# EAGLE design shield (EAGLE 6.6.0)
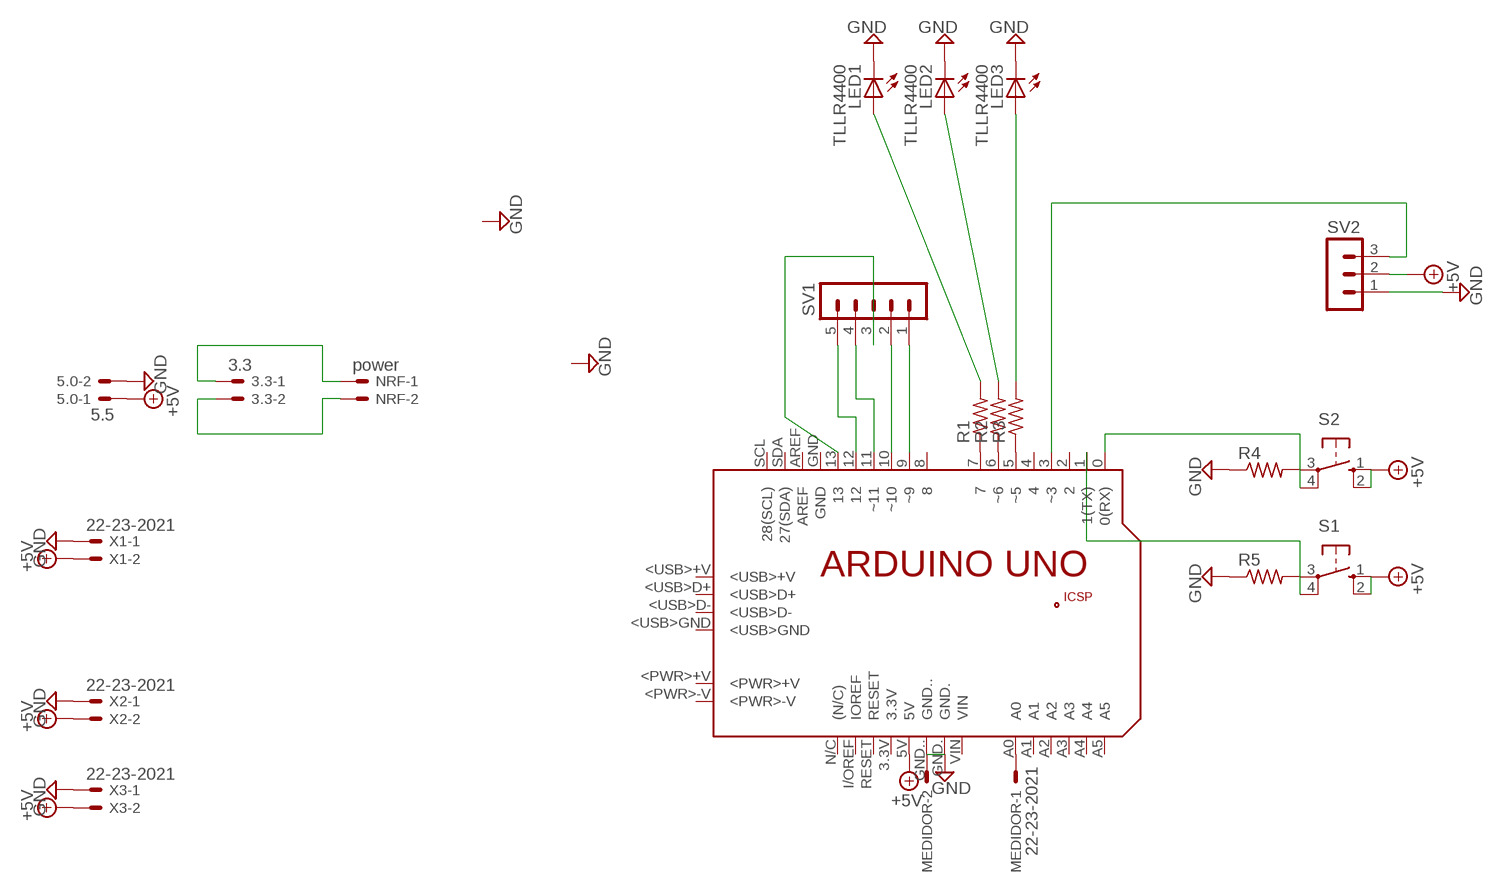
[diagram p0: schematic, sheet 1]

## Parts
3.3  3.3  22-23-2021  [22-23-2021]
5.0  5.5  22-23-2021  [22-23-2021]
LED1  TLLR4400  [LED3MM]
LED2  TLLR4400  [LED3MM]
LED3  TLLR4400  [LED3MM]
MEDIDOR  22-23-2021  [22-23-2021]
NRF  power  22-23-2021  [22-23-2021]
PCB1  ARDUINO_UNO  [ARDUINO_UNO]
R1  R-US_0613/15  [P0613/15]
R2  R-US_0613/15  [P0613/15]
R3  R-US_0613/15  [P0613/15]
R4  R-US_0613/15  [P0613/15]
R5  R-US_0613/15  [P0613/15]
S1  10-XX  [B3F-10XX]
S2  10-XX  [B3F-10XX]
SV1  MA05-1  [MA05-1]
SV2  MA03-1  [MA03-1]
X1  22-23-2021  [22-23-2021]
X2  22-23-2021  [22-23-2021]
X3  22-23-2021  [22-23-2021]

## Nets
+5V: 5.0.1 PCB1.5V S1.1(S) S1.2(S1) S2.1(S) S2.2(S1) SV2.2 X1.2 X2.2 X3.2
GND: 5.0.2 LED1.K(C) LED2.K(C) LED3.K(C) MEDIDOR.2 PCB1.GND. PCB1.GND.. R4.1 R5.1 SV2.1 X1.1 X2.1 X3.1
N$1: PCB1.3(~3) SV2.3
N$2: PCB1.9(~9) SV1.1
N$3: PCB1.10(~10) SV1.2
N$4: PCB1.13 SV1.3
N$5: PCB1.11(~11) SV1.4
N$6: PCB1.12 SV1.5
N$7: PCB1.0(0(RX)) R4.2 S2.3(P) S2.4(P1)
N$8: PCB1.7 R1.1
N$9: PCB1.6(~6) R2.1
N$10: PCB1.5(~5) R3.1
N$11: LED3.A R3.2
N$12: LED2.A R2.2
N$13: LED1.A R1.2
N$14: PCB1.1(1(TX)) R5.2 S1.3(P) S1.4(P1)
N$15: MEDIDOR.1 PCB1.A0
N$16: 3.3.1 NRF.1
N$17: 3.3.2 NRF.2
Unconnected: PCB1.2 PCB1.3.3V PCB1.4 PCB1.8 PCB1.+5V PCB1.<PWR>+V PCB1.<PWR>-V PCB1.<USB>+V PCB1.<USB>D+ PCB1.<USB>D- PCB1.<USB>GND PCB1.A1 PCB1.A2 PCB1.A3 PCB1.A4 PCB1.A5 PCB1.AREF PCB1.GND PCB1.GND_ PCB1.I/OREF(IOREF) PCB1.MISO PCB1.MOSI PCB1.N/C((N/C)) PCB1.RESET PCB1.RESET. PCB1.SCK PCB1.SCL(28(SCL)) PCB1.SDA(27(SDA)) PCB1.VIN

## Library data of the parts
3.3 5.0 MEDIDOR NRF X1-X3 = con-molex:22-23-2021: .100" (2.54mm) Center Header - 2 Pin; MF: MOLEX; MPN: 22-23-2021; OC_FARNELL: 1462926; OC_NEWARK: 25C3832
LED1-LED3 = led:TLLR4400: Low Current (2mA) LED 3 mm Tinted Diffused Package color RED Source: Data sheet <http://www.farnell.com/datasheets/391100.pdf>; MF: VISHAY SEMICONDUCTOR; OC_FARNELL: 1612437
PCB1 = E14_Arduino_revC:ARDUINO_UNO: Device for representing an Arduino Uno board with a footprint in an EAGLE design. Created by Dave Young for Element14. More EAGLE documentation at: http://www.element14.com/community/community/knode/cadsoft_eagle
R1-R5 = rcl:R-US_: RESISTOR, American symbol
S1 S2 = switch-omron:10-XX: OMRON SWITCH; MPN: B3F-1000; OC_FARNELL: 176432; OC_NEWARK: 36M3542
SV1 = con-lstb:MA05-1: PIN HEADER; OC_FARNELL: unknown; OC_NEWARK: unknown
SV2 = con-lstb:MA03-1: PIN HEADER; OC_FARNELL: unknown; OC_NEWARK: unknown

## Board
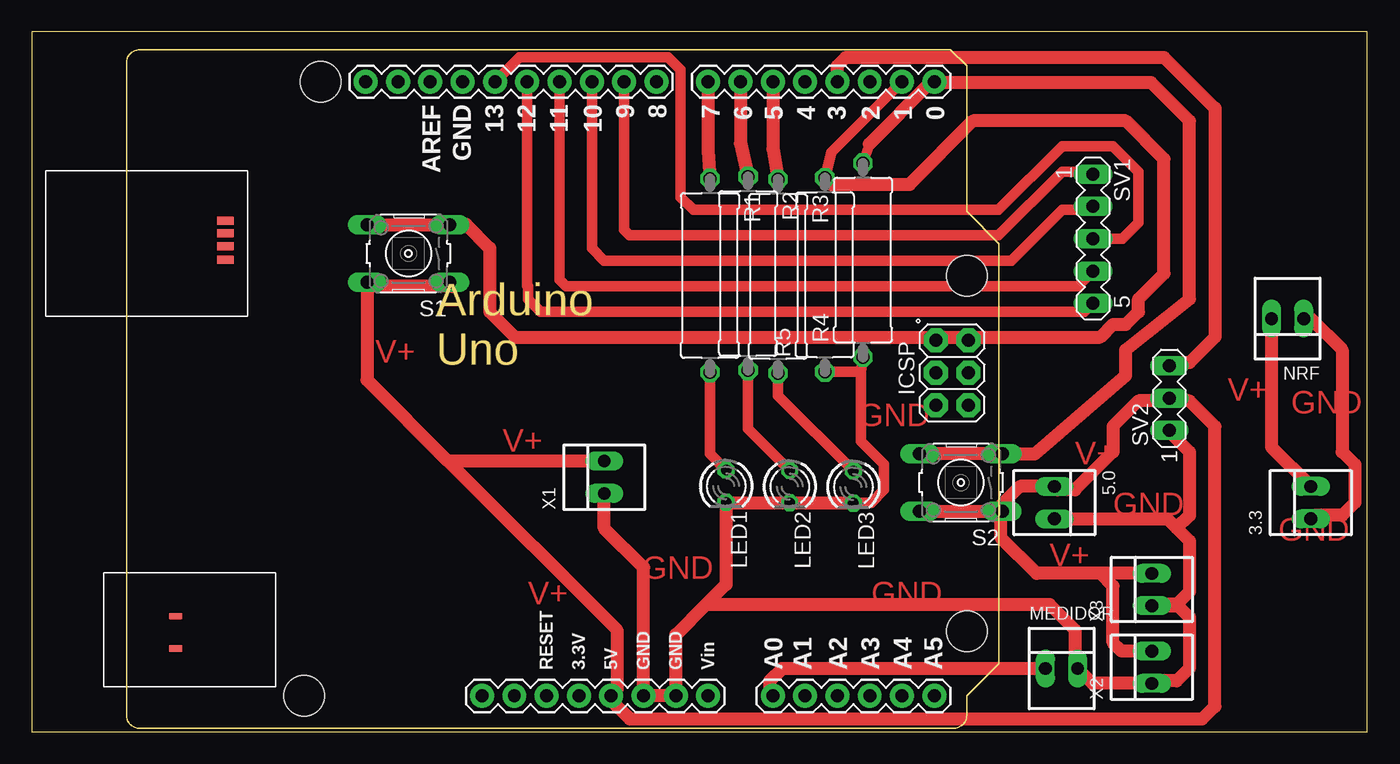
[diagram p1: board, top side]

Size 105 x 55 mm. Coordinates in mm from the lower left corner, seen from the top.
Outline: 0,0 105,0 105,55 0,55 0,0
Copper layers (1*16): Top 0.035mm / dielectric 1.5mm / Bottom 0.035mm
Design rules "default": minimum track width 10mil, minimum drill 24mil, track to track 8mil, track to pad 8mil, pad to pad 8mil, via to via 8mil, smd to smd 8mil, copper to edge 40mil, drill to drill 8mil, minimum pad ring 10mil, minimum via ring 8mil, stop-mask expansion 4mil, vias tented up to drill 0mil, thermal gap 10mil

### Footprints (pad centres in the part's own frame; a part is rotated, then mirrored left to right if it is on the bottom)
22-23-2021 = drill 1 long: 1 -1.27,0; 2 1.27,0
LED3MM = drill 0.813 octagon: A -1.27,0; K 1.27,0
ARDUINO_UNO = drill 1.016 pad 1.88: 0 63.5,50.8; 1 60.96,50.8; 2 58.42,50.8; 3 55.88,50.8; 3.3V 35.56,2.54; 4 53.34,50.8; 5 50.8,50.8; 5V 38.1,2.54; 6 48.26,50.8; 7 45.72,50.8; 8 41.656,50.8; 9 39.116,50.8; 10 36.576,50.8; 11 34.036,50.8; 12 31.496,50.8; 13 28.956,50.8; A0 50.8,2.54; A1 53.34,2.54; A2 55.88,2.54; A3 58.42,2.54; A4 60.96,2.54; A5 63.5,2.54; AREF 23.876,50.8; GND 26.416,50.8; GND. 43.18,2.54; GND.. 40.64,2.54; I/OREF 30.48,2.54; N/C 27.94,2.54; RESET 33.02,2.54; SCL 18.796,50.8; SDA 21.336,50.8; VIN 45.72,2.54 | drill 1.016 pad 1.88 octagon: +5V 66.167,30.48; GND_ 66.167,25.4; MISO 63.627,30.48; MOSI 66.167,27.94; RESET. 63.627,25.4; SCK 63.627,27.94 | smd 1.016 x 0.508: <PWR>+V 3.861,8.814; <PWR>-V 3.861,6.274 | smd 1.27 x 0.635: <USB>+V 7.772,39.878; <USB>D+ 7.772,38.887; <USB>D- 7.772,37.871; <USB>GND 7.772,36.83 | hole 3.2: 66.04,7.62; 66.04,35.56; 15.24,50.8; 13.97,2.54
P0613/15 = drill 1.016 octagon: 1 -7.62,0; 2 7.62,0
B3F-10XX = drill 1.016 long: 1 -3.251,2.261; 2 3.251,2.261; 3 -3.251,-2.261; 4 3.251,-2.261
MA05-1 = drill 1.016 long: 1 -5.08,0; 2 -2.54,0; 3 0,0; 4 2.54,0; 5 5.08,0
MA03-1 = drill 1.016 long: 1 -2.54,0; 2 0,0; 3 2.54,0

### Placement (x,y rotation side)
3.3  100.54,18 90 top
5.0  80.38,18 270 top
LED1  54.58,19.29 270 top
LED2  59.58,19.26 270 top
LED3  64.58,19.23 270 top
MEDIDOR  80.95,4.96 0 top
NRF  98.72,32.46 180 top
PCB1  7.45,0.27 0 top
R1  53.31,35.85 270 top
R2  56.31,36.01 270 top
R3  58.66,35.78 270 top
R4  65.34,37.06 90 top
R5  62.34,35.9 90 top
S1  29.61,37.58 180 top
S2  73.04,19.58 180 top
SV1  83.42,38.74 270 top
SV2  89.42,26.22 90 top
X1  45,20 90 top
X2  88.04,5.06 90 top
X3  88.04,11.17 90 top

### Tracks (layer width: path | path; a pad name or v marks a point on that pad's centre or on a via)
+5V
  Top 1.016: 89.64,26 91,26 93,24 93,2 92,1 47,1 45.55,2.45 PCB1.5V 46,3.26 46,8 32.73,21.27 | 89.64,26 SV2.2 | S2.2 S2.1 | S1.1 32.86,35.14 33,35 26.68,35 S1.2 26.36,27.64 32.73,21.27 | S2.1 76.2,17.41 76.2,17.78 77.69,19.27 5.0.1 80.65,19 82,19 85,22 85,24 87,26 89.64,26 | X3.2 84,12.44 | 84,12.44 79,12.44 76.2,15.24 76.2,17.23 S2.1 | X1.2 32.73,21.27 | X2.2 85.67,6.33 85,7 85,11.44 84,12.44
GND
  Top 0.813: R5.1 65.18,28.28 | 65.18,28.28 R4.1 | 65.18,28.28 65.18,22.82 67,21 67,19 66,18 64.62,18 LED3.K
  Top 1.016: 89.99,16.01 91,15 91,11 90,10 88.14,10 X3.1 90.1,9.9 91,9 91,5 90,4 88.25,4 X2.1 83.39,3.79 MEDIDOR.2 82,5.18 82,8 80,10 53,10 | 90.32,22.68 89.32,23.68 SV2.1 90.32,22.68 | 90.32,22.68 91,22 91,17 90.98,17 89.99,16.01 | 53,10 50.63,7.63 PCB1.GND. PCB1.GND.. 48.09,12.91 45,16 X1.1 | 53,10 54.58,11.58 LED1.K 54.64,17.96 LED3.K 64.55,17.96 LED2.K | 5.0.2 89.27,16.73 89.99,16.01
N$1
  Top 1.016: PCB1.3 63.33,52.33 64,53 89,53 93,49 93,31 91,29 89.66,29 SV2.3
N$2
  Top 0.813: PCB1.9 46.57,39.43 47,39 76,39 81,44 83.24,44 SV1.1
N$3
  Top 0.813: PCB1.10 44.03,37.97 45,37 77,37 81,41 83.14,41 SV1.2
N$4
  Top 0.813: SV1.3 85.74,38.74 87,40 87,44 85,46 81,46 76,41 52,41 51,42 51,52 50,53 38.34,53 PCB1.13
N$5
  Top 0.813: PCB1.11 41.49,35.51 42,35 82.22,35 SV1.4
N$6
  Top 0.813: PCB1.12 38.95,35.05 39,35 39,34 40,33 82.76,33 SV1.5
N$7
  Top 0.813: PCB1.0 70.73,51.07 70.66,51 | 65.83,46.17 R4.2
  Top 1.016: S2.4 69.95,22 70,22 70.16,21.84 S2.3 78.84,21.84 86,28 86,30 91,34 91,48 88,51 70.66,51 65.83,46.17
N$8
  Top 1.016: PCB1.7 53.17,45.61 R1.1
N$9
  Top 1.016: PCB1.6 55.71,46.23 R2.1
N$10
  Top 1.016: PCB1.5 58.25,45.81 R3.1
N$11
  Top 0.813: R3.2 58.66,26.42 LED3.A
N$12
  Top 0.813: R2.2 56.31,23.8 LED2.A
N$13
  Top 0.813: R1.2 53.31,21.83 LED1.A
N$14
  Top 0.813: R5.2 62.86,45.52 PCB1.1
  Top 1.016: S1.4 S1.3 34.16,39.84 36,38 36,33 38,31 84,31 85,32 86,32 87,33 87,34 89,36 89,45 86,48 74,48 69,43 62.86,43 R5.2
N$15
  Top 1.016: MEDIDOR.1 58.96,4.96 58,4 58,3.06 PCB1.A0
N$16
  Top 1.016: NRF.1 100.54,32.46 103,30 103,22 104,21 104,18 103,17 100.81,17 3.3.1
N$17
  Top 1.016: NRF.2 97.45,22.36 3.3.2

### Text on the board
Top: V+ | V+ | GND | GND | V+ | V+ | GND | GND | V+ | GND | V+ | GND